# Altium project XInC2 Dev v2.0.0.PrjPCB
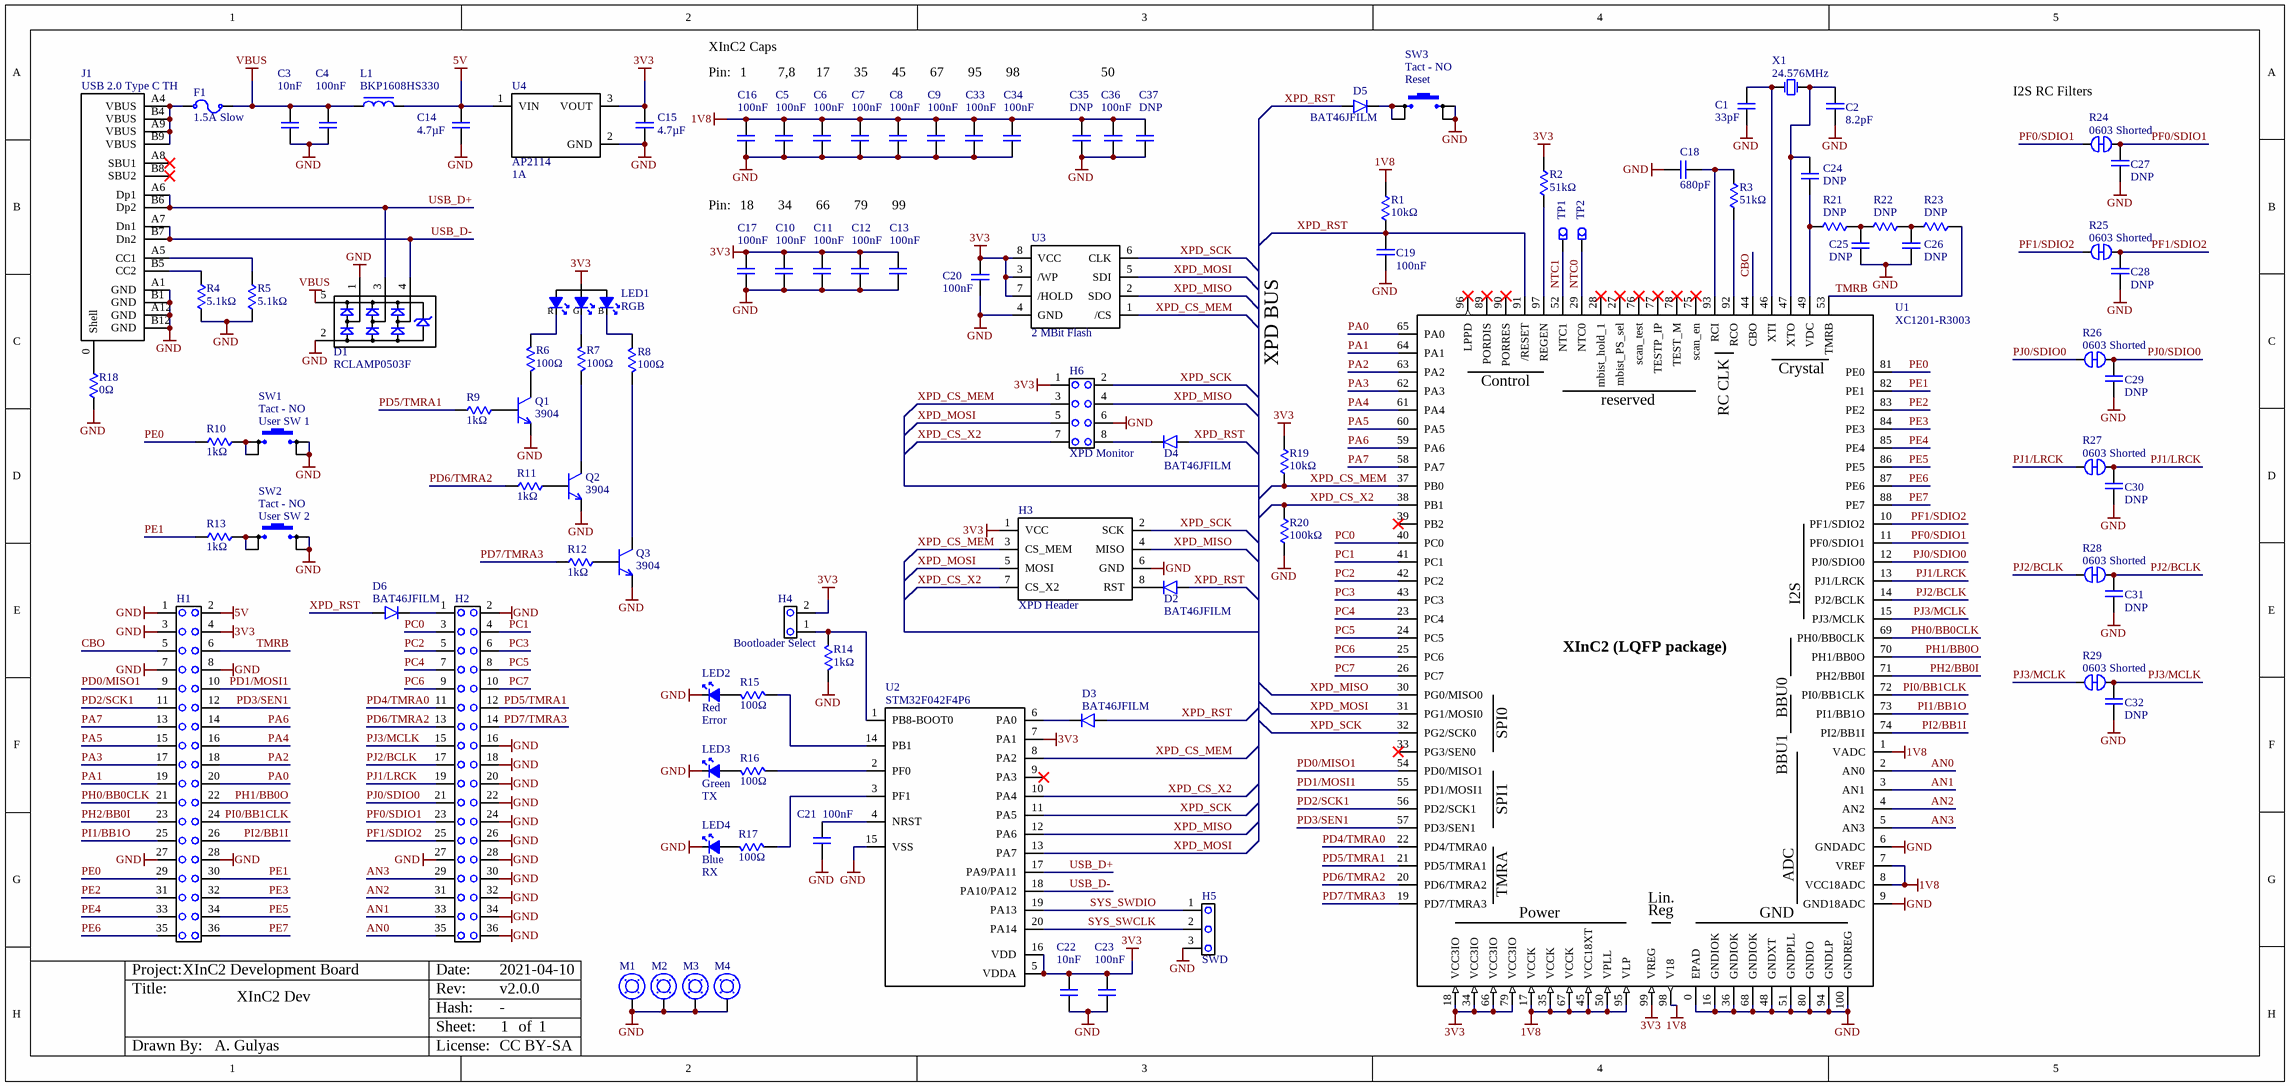
[diagram p0: XInC2 Dev - SCH v2.0.0 20210410.SchDoc]
1 sheet, 102 parts. Net scope: global (net labels, ports and power ports of the same name join across sheets).
Board file: XInC2 Dev - PCB v2.0 20210410.PcbDoc

## Sheet XInC2 Dev - SCH v2.0.0 20210410.SchDoc
size 457 x 215 mm; Date: 2021-04-10; Author: A. Gulyas; DrawnBy: A. Gulyas; Engineer: A. Gulyas; Revision: v2.0.0; SheetNumber: 1; SheetTotal: 1; Githash: -

### Parts
C1  33pF  [0603 - C]
C2  8.2pF  [0603 - C]
C3  10nF  [0603 - C]
C4  100nF  [0603 - C]
C5  100nF  [0603 - C]
C6  100nF  [0603 - C]
C7  100nF  [0603 - C]
C8  100nF  [0603 - C]
C9  100nF  [0603 - C]
C10  100nF  [0603 - C]
C11  100nF  [0603 - C]
C12  100nF  [0603 - C]
C13  100nF  [0603 - C]
C14  4.7µF  [0603 - C]
C15  4.7µF  [0603 - C]
C16  100nF  [0603 - C]
C17  100nF  [0603 - C]
C18  680pF  [0603 - C]
C19  100nF  [0603 - C]
C20  100nF  [0603 - C]
C21  100nF  [0603 - C]
C22  10nF  [0603 - C]
C23  100nF  [0603 - C]
C24  DNP  [0603 - C - DNP]
C25  DNP  [0603 - C - DNP]
C26  DNP  [0603 - C - DNP]
C27  DNP  [0603 - C - DNP]
C28  DNP  [0603 - C - DNP]
C29  DNP  [0603 - C - DNP]
C30  DNP  [0603 - C - DNP]
C31  DNP  [0603 - C - DNP]
C32  DNP  [0603 - C - DNP]
C33  100nF  [0603 - C]
C34  100nF  [0603 - C]
C35  DNP  [0603 - C - DNP]
C36  100nF  [0603 - C]
C37  DNP  [0603 - C - DNP]
D1  RCLAMP0503F  [SOT 353]
D2  BAT46JFILM  [SOD 323]
D3  BAT46JFILM  [SOD 323]
D4  BAT46JFILM  [SOD 323 and 0603]
D5  BAT46JFILM  [SOD 323]
D6  BAT46JFILM  [SOD 323]
F1  1.5A Slow  [Fuse - C1T Series]
H1  SSQ-118-03-T-D  [H - 100mil - 2x18 - Stack - bottom insert]  (value not drawn)
H2  SSQ-118-03-T-D  [H - 100mil - 2x18 - Stack - bottom insert]  (value not drawn)
H3  XPD Header  [H - XPD]
H4  Purpose: Bootloader Select  [H - 100mil - 1x2 - TH]  (hidden comment: H - 100mil - M - TH - 1x2)
H5  Purpose: SWD  [H - 100mil - 1x3 - TH]  (hidden comment: H - 100mil - M - TH - 1x3)
H6  Purpose: XPD Monitor  [H - 100mil - 2x4 - TH - DNP]  (hidden comment: H - 100mil - M - TH - 2x4)
J1  USB 2.0 Type C TH  [Jack - USB C - 2.0 - TH]
L1  BKP1608HS330  [0603 - R]
LED1  RGB  [LED - RGB - 0606]
LED2  Red  Purpose: Error  [LED - Red - 0603]
LED3  Green  Purpose: TX  [LED - Green - 0603]
LED4  Blue  Purpose: RX  [LED - Blue - 0603]
M1  Mech - Bolt Hole - M3  [Bolt Hole - M3]  (value not drawn)
M2  Mech - Bolt Hole - M3  [Bolt Hole - M3]  (value not drawn)
M3  Mech - Bolt Hole - M3  [Bolt Hole - M3]  (value not drawn)
M4  Mech - Bolt Hole - M3  [Bolt Hole - M3]  (value not drawn)
Q1  3904  [SOT 23 - NPN - MCC]
Q2  3904  [SOT 23 - NPN - MCC]
Q3  3904  [SOT 23 - NPN - MCC]
R1  10kΩ  [0603 - R]
R2  51kΩ  [0603 - R]
R3  51kΩ  [0603 - R]
R4  5.1kΩ  [0603 - R]
R5  5.1kΩ  [0603 - R]
R6  100Ω  [0603 - R]
R7  100Ω  [0603 - R]
R8  100Ω  [0603 - R]
R9  1kΩ  [0603 - R]
R10  1kΩ  [0603 - R]
R11  1kΩ  [0603 - R]
R12  1kΩ  [0603 - R]
R13  1kΩ  [0603 - R]
R14  1kΩ  [0603 - R]
R15  100Ω  [0603 - R]
R16  100Ω  [0603 - R]
R17  100Ω  [0603 - R]
R18  0Ω  [0603 - R]
R19  10kΩ  [0603 - R]
R20  100kΩ  [0603 - R]
R21  DNP  [0603 - R - DNP]
R22  DNP  [0603 - R - DNP]
R23  DNP  [0603 - R - DNP]
R24  0603 Shorted  [0603 - R - shorted jumper]
R25  0603 Shorted  [0603 - R - shorted jumper]
R26  0603 Shorted  [0603 - R - shorted jumper]
R27  0603 Shorted  [0603 - R - shorted jumper]
R28  0603 Shorted  [0603 - R - shorted jumper]
R29  0603 Shorted  [0603 - R - shorted jumper]
SW1  Tact - NO  Purpose: User SW 1  [SW - Tact - SMT]
SW2  Tact - NO  Purpose: User SW 2  [SW - Tact - SMT]
SW3  Tact - NO  Purpose: Reset  [SW - Tact - SMT]
TP1  Signal  [TP - TH - 0.6mm]  (value not drawn)
TP2  Signal  [TP - TH - 0.6mm]  (value not drawn)
U1  XC1201-R3003  [XInC2 LQFP 100]
U2  STM32F042F4P6  [TSSOP 20]
U3  2 MBit Flash  [SOIC 8]
U4  AP2114  Current - Output: 1A  [SOT 223]
X1  24.576MHz  [X - HC-49/US]

### Nets
1V8: C5.1 C6.1 C7.1 C8.1 C9.1 C16.1 C33.1 C34.1 C35.1 C36.1 C37.1 R1.2 U1.1(VADC) U1.7(VREF) U1.8(VCC18ADC) U1.17(VCCK) U1.35(VCCK) U1.45(VCC18XT) U1.50(VPLL) U1.67(VCCK) U1.95(VLP) U1.98(V18)
3V3: C10.1 C11.1 C12.1 C13.1 C15.1 C17.1 C20.1 C22.1 C23.1 H1.4 H3.1(VCC) H4.2 H6.1 LED1.4 R2.2 R19.2 U1.18(VCC3IO) U1.34(VCC3IO) U1.66(VCC3IO) U1.79(VCC3IO) U1.99(VREG) U2.5(VDDA) U2.7(PA1) U2.16(VDD) U3.3(/WP) U3.7(/HOLD) U3.8(VCC) U4.3(VOUT)
5V: C14.1 H1.2 L1.2 U4.1(VIN)
GND: C1.2 C2.2 C3.2 C4.2 C5.2 C6.2 C7.2 C8.2 C9.2 C10.2 C11.2 C12.2 C13.2 C14.2 C15.2 C16.2 C17.2 C18.1 C19.2 C20.2 C21.2 C22.2 C23.2 C25.2 C26.2 C27.2 C28.2 C29.2 C30.2 C31.2 C32.2 C33.2 C34.2 C35.2 C36.2 C37.2 D1.1 D1.2 H1.1 H1.3 H1.7 H1.8 H1.27 H1.28 H2.2 H2.16 H2.18 H2.20 H2.22 H2.24 H2.26 H2.27 H2.28 H2.30 H2.32 H2.34 H2.36 H3.6(GND) H5.3 H6.6 J1.A1(GND) J1.A12(GND) J1.B1(GND) J1.B12(GND) LED2.2 LED3.2 LED4.2 M1.1 M2.1 M3.1 M4.1 Q1.E Q2.E Q3.E R4.1 R5.1 R14.1 R18.1 R20.1 SW1.1 SW1.2 SW2.1 SW2.2 SW3.1 SW3.2 U1.0(EPAD) U1.6(GNDADC) U1.9(GND18ADC) U1.16(GNDIOK) U1.36(GNDIOK) U1.48(GNDXT) U1.51(GNDPLL) U1.68(GNDIOK) U1.80(GNDIO) U1.94(GNDLP) U1.100(GNDREG) U2.15(VSS) U3.4(GND) U4.2(GND)
VBUS: C3.1 C4.1 D1.5 F1.2 L1.1
AN0: H2.35 U1.2(AN0)
AN1: H2.33 U1.3(AN1)
AN2: H2.31 U1.4(AN2)
AN3: H2.29 U1.5(AN3)
CBO: H1.5 U1.44(CBO)
NTC0: TP2.1 U1.29(NTC0)
NTC1: TP1.1 U1.52(NTC1)
PA0: H1.20 U1.65(PA0)
PA1: H1.19 U1.64(PA1)
PA2: H1.18 U1.63(PA2)
PA3: H1.17 U1.62(PA3)
PA4: H1.16 U1.61(PA4)
PA5: H1.15 U1.60(PA5)
PA6: H1.14 U1.59(PA6)
PA7: H1.13 U1.58(PA7)
PC0: H2.3 U1.40(PC0)
PC1: H2.4 U1.41(PC1)
PC2: H2.5 U1.42(PC2)
PC3: H2.6 U1.43(PC3)
PC4: H2.7 U1.23(PC4)
PC5: H2.8 U1.24(PC5)
PC6: H2.9 U1.25(PC6)
PC7: H2.10 U1.26(PC7)
PD0/MISO1: H1.9 U1.54(PD0/MISO1)
PD1/MOSI1: H1.10 U1.55(PD1/MOSI1)
PD2/SCK1: H1.11 U1.56(PD2/SCK1)
PD3/SEN1: H1.12 U1.57(PD3/SEN1)
PD4/TMRA0: H2.11 U1.22(PD4/TMRA0)
PD5/TMRA1: H2.12 R9.1 U1.21(PD5/TMRA1)
PD6/TMRA2: H2.13 R11.1 U1.20(PD6/TMRA2)
PD7/TMRA3: H2.14 R12.1 U1.19(PD7/TMRA3)
PE0: H1.29 R10.1 U1.81(PE0)
PE1: H1.30 R13.1 U1.82(PE1)
PE2: H1.31 U1.83(PE2)
PE3: H1.32 U1.84(PE3)
PE4: H1.33 U1.85(PE4)
PE5: H1.34 U1.86(PE5)
PE6: H1.35 U1.87(PE6)
PE7: H1.36 U1.88(PE7)
PF0/SDIO1: C27.1 H2.23 R24.1 R24.2 U1.11(PF0/SDIO1)
PF1/SDIO2: C28.1 H2.25 R25.1 R25.2 U1.10(PF1/SDIO2)
PH0/BB0CLK: H1.21 U1.69(PH0/BB0CLK)
PH1/BB0O: H1.22 U1.70(PH1/BB0O)
PH2/BB0I: H1.23 U1.71(PH2/BB0I)
PI0/BB1CLK: H1.24 U1.72(PI0/BB1CLK)
PI1/BB1O: H1.25 U1.73(PI1/BB1O)
PI2/BB1I: H1.26 U1.74(PI2/BB1I)
PJ0/SDIO0: C29.1 H2.21 R26.1 R26.2 U1.12(PJ0/SDIO0)
PJ1/LRCK: C30.1 H2.19 R27.1 R27.2 U1.13(PJ1/LRCK)
PJ2/BCLK: C31.1 H2.17 R28.1 R28.2 U1.14(PJ2/BCLK)
PJ3/MCLK: C32.1 H2.15 R29.1 R29.2 U1.15(PJ3/MCLK)
SYS_SWCLK: H5.2 U2.20(PA14)
SYS_SWDIO: H5.1 U2.19(PA13)
TMRB: H1.6 R23.2 U1.53(TMRB)
USB_D+: D1.3 J1.A6(Dp1) J1.B6(Dp2) U2.17(PA9/PA11)
USB_D-: D1.4 J1.A7(Dn1) J1.B7(Dn2) U2.18(PA10/PA12)
XPD_CS_MEM: H3.3(CS_MEM) H6.3 R19.1 U1.37(PB0) U2.8(PA2) U3.1(/CS)
XPD_CS_X2: H3.7(CS_X2) H6.7 R20.2 U1.38(PB1) U2.10(PA4)
XPD_MISO: H3.4(MISO) H6.4 U1.30(PG0/MISO0) U2.12(PA6) U3.2(SDO)
XPD_MOSI: H3.5(MOSI) H6.5 U1.31(PG1/MOSI0) U2.13(PA7) U3.5(SDI)
XPD_RST: C19.1 D2.1 D3.1 D4.1 D5.1 D6.1 R1.1 U1.91(/RESET)
XPD_SCK: H3.2(SCK) H6.2 U1.32(PG2/SCK0) U2.11(PA5) U3.6(CLK)
NetC1_1: C1.1 U1.46(XTI) X1.1
NetC2_1: C2.1 C24.1 U1.47(XTO) X1.2
NetC18_2: C18.2 R3.2 U1.93(RCI)
NetC21_1: C21.1 U2.4(NRST)
NetC24_2: C24.2 R21.1 U1.49(VDC)
NetC25_1: C25.1 R21.2 R22.1
NetC26_1: C26.1 R22.2 R23.1
NetD2_2: D2.2 H3.8(RST)
NetD3_2: D3.2 U2.6(PA0)
NetD4_2: D4.2 H6.8
NetD5_2: D5.2 SW3.3 SW3.4
NetD6_2: D6.2 H2.1
NetF1_1: F1.1 J1.A4(VBUS) J1.A9(VBUS) J1.B4(VBUS) J1.B9(VBUS)
NetH4_1: H4.1 R14.2 U2.1(PB8-BOOT0)
NetJ1_0: J1.0(Shell) R18.2
NetJ1_A5: J1.A5(CC1) R5.2
NetJ1_B5: J1.B5(CC2) R4.2
NetLED1_1: LED1.1 R6.1
NetLED1_2: LED1.2 R7.1
NetLED1_3: LED1.3 R8.2
NetLED2_1: LED2.1 R15.2
NetLED3_1: LED3.1 R16.2
NetLED4_1: LED4.1 R17.1
NetQ1_B: Q1.B R9.2
NetQ1_C: Q1.C R6.2
NetQ2_B: Q2.B R11.2
NetQ2_C: Q2.C R7.2
NetQ3_B: Q3.B R12.2
NetQ3_C: Q3.C R8.1
NetR2_1: R2.1 U1.97(REGEN)
NetR3_1: R3.1 U1.92(RCO)
NetR10_2: R10.2 SW1.3 SW1.4
NetR13_2: R13.2 SW2.3 SW2.4
NetR15_1: R15.1 U2.14(PB1)
NetR16_1: R16.1 U2.2(PF0)
NetR17_2: R17.2 U2.3(PF1)

Not connected (* = marked no-connect by the designer): J1 A8(SBU1)* B8(SBU2)*; U1 27(mbist_PS_sel)* 28(mbist_hold_1)* 33(PG3/SEN0)* 39(PB2)* 75(scan_en)* 76(scan_test)* 77(TESTP_IP)* 78(TEST_M)* 89(PORDIS)* 90(PORRES)* 96(LPPD)*; U2 9(PA3)*

### Notes on the sheet
- XInC2 Caps
- Pin:
- 1
- 7,8
- 17
- 35
- 45
- 67
- 95
- 98
- 50
- I2S RC Filters
- 18
- 34
- 66
- 79
- 99
- XPD BUS
- (near H1) Project:
- (near H1) XInC2 Development Board
- (near H2) Date:
- (near H1) Title:
- XInC2 Dev
- (near H2) Rev:
- Hash:
- Sheet:
- of
- Drawn By:
- License:
- CC BY-SA
- (in symbol LED - RGB) R; G; B
- (in symbol uC - XInC2 - LQFP) Crystal; Control; reserved; RC CLK; I2S; XInC2 (LQFP package); BBU0; BBU1; SPI0; SPI1; ADC; TMRA; Lin.; Power; Reg; GND

### Library data of the parts
C1 = C - 0603 - 33pF - 16V_1: CAP CER 33PF 50V C0G/NPO 0603; MFG: Yageo; MFG PN: CC0603JRNPO9BN330; Tolerance: ±5%; Temp Coeff: NP0; Op Temp: -55°C ~ 125°C; Digi-Key PN: 311-1064-1-ND; Value: 33pF; Package: 0603; Series: CC; Price/1 @10: $0.058; Height: 0.9 mm; Composition: Ceramic; Voltage - Rated: 50V; Mounting Type: Surface Mount, MLCC
C2 = C - 0603 - 8.2pF - 50V: CAP CER 8.2PF 50V NPO 0603; MFG: Yageo; MFG PN: CC0603CRNPO9BN8R2; Tolerance: ±0.25pF; Temp Coeff: NP0; Op Temp: -55°C ~ 125°C; Digi-Key PN: 311-3865-1-ND; Value: 8.2pF; Package: 0603; Series: CC; Price/1 @10: $0.084; Height: 0.90mm; Composition: Ceramic; Voltage - Rated: 50V; Mounting Type: Surface Mount, MLCC
C3 C22 = C - 0603 - 10nF - 50V: CAP CER 10000PF 50V X7R 0603; MFG: Yageo; MFG PN: CC0603JRX7R9BB103; Tolerance: ±5%; Op Temp: -55°C ~ 125°C; Digi-Key PN: 311-1778-1-ND; Value: 10000pF; Package: 0603; Temp Coeff: X7R; Series: CC; Price/1 @10: $0.072; Height: 0.90mm; Composition: Ceramic; Voltage - Rated: 50V; Mounting Type: Surface Mount, MLCC; Size: 1.60mm x 0.80mm
C4-C13 C16 C17 C19-C21 C23 C33 C34 C36 = C - 0603 - 100nF - 16V: CAP CER 0.1UF 16V X7R 0603; MFG: Yageo; MFG PN: CC0603KRX7R7BB104; Value: 0.1µF; Tolerance: ±10%; Op Temp: -55°C ~ 125°C; Digi-Key PN: 311-1088-1-ND; Package: 0603; Temp Coeff: X7R; Series: CC; Price/1 @10: $0.064; Height: 0.9 mm; Composition: Ceramic; Voltage - Rated: 16V; Mounting Type: Surface Mount, MLCC
C14 C15 = C - 0603 - 4.7uF - 10V: CAP CER 4.7UF 10V X5R 0603; MFG: Yageo; MFG PN: CC0603MRX5R6BB475; Tolerance: ±20%; Op Temp: -55°C ~ 85°C; Digi-Key PN: 311-1820-1-ND; Value: 4.7µF; Package: 0603; Temp Coeff: X5R; Series: CC; Price/1 @10: $0.172; Height: 0.90mm; Composition: Ceramic; Voltage - Rated: 10V; Mounting Type: Surface Mount, MLCC
C18 = C - 0603 - 680pF - 50V: CAP CER 680PF 50V X7R 0603; MFG: Yageo; MFG PN: CC0603KRX7R9BB681; Tolerance: ±10%; Op Temp: -55°C ~ 125°C; Digi-Key PN: 311-1188-1-ND; Value: 680pF; Package: 0603; Temp Coeff: X7R; Series: CC; Price/1 @10: $0.062; Height: 0.90mm; Composition: ceramic; Voltage - Rated: 50V; Mounting Type: Surface Mount, MLCC
C24-C32 C35 C37 = C - 0603 - DNP: DNP C 0603; MFG: -; MFG PN: -; Digi-Key PN: -; Value: DNP; Package: 0603; Mounting Type: SMT
D1 = TVS - USB - RCLAMP0503F: TVS DIODE 5V 25V SC70-5; MFG: Semtech Corp; MFG PN: RCLAMP0503F.TCT; Op Temp: -55°C ~ 125°C (TJ); Type: Steering (Rail to Rail); Voltage - Reverse Standoff (Typ): 5V (Max); Voltage - Breakdown (Min): 6V; Current - Peak Pulse (10/1000µs): 6A (8/20µs); Power - Peak Pulse: 150W; Power Line Protection: Yes; Capacitance @ Frequency: 3pF @ 1MHz; Unidirectional Channels: 3; Digi-Key PN: RCLAMP0503F.TCTCT-ND; Mounting Type: Surface Mount; Package: 5-TSSOP, SC-70-5, SOT-353; Series: RailClamp; Voltage - Clamping (Max) @ Ipp: 25V; Applications: USB OTG; ComponentLink1Description: Datasheet; ComponentLink1URL: E:\!Projects\50. XInC2 Dev 2\git\Datasheets\Semtech - RClamp0503F.pdf; ComponentLink2Description: Online Datasheet; ComponentLink2URL: https://semtech.my.salesforce.com/sfc/p/#E0000000JelG/a/44000000MCna/gSoiWcGuNPdCJXQ9MiJb.gsVfITyRqZHeVmym5XjXO8
D2-D6 = D - BAT46JFILM: DIODE SCHOTTKY 100V 150MA SOD323; MFG: ST; Op Temp: 150°C (Max); Current - Average Rectified (Io): 150mA (DC); Speed: Small Signal =< 200mA (Io), Any Speed; Capacitance @ Vr, F: 10pF @ 0V, 1MHz; Voltage - Forward (Vf) (Max) @ If: 450mV @ 10mA; Current - Reverse Leakage @ Vr: 5µA @ 75V; Digi-Key PN: 497-6653-1-ND; MFG PN: BAT46JFILM; Mounting Type: Surface Mount; Package: SOD-323; Price/1 @10: $0.231; Series: -; Diode Type: Schottky; Voltage - DC Reverse (Vr) (Max): 100V; ComponentLink1Description: Datasheet; ComponentLink1URL: E:\!Projects\50. XInC2 Dev 2\git\Datasheets\ST - BAT46.pdf; ComponentLink2Description: Online Datasheet; ComponentLink2URL: https://www.st.com/content/ccc/resource/technical/document/datasheet/c6/32/d4/4a/28/d3/4b/11/CD00004930.pdf/files/CD00004930.pdf/jcr:content/translations/en.CD00004930.pdf
F1 = Fuse - 1.5A slow: FUSE 1.5A 63VAC/DC SLOW 1206; MFG: Bel Fuse Inc.; MFG PN: 0685T1500-01; Fuse Type: Board Mount (Cartridge Style Excluded); Response Time: Slow Blow; Breaking Capacity @ Rated Voltage: 50A; Approval Agency: AEC-Q200, CE, cURus; Op Temp: -55°C ~ 125°C; Melting I²t: 0.23; Voltage Rating - AC: 63V; DC Cold Resistance: 0.205 Ohms; Digi-Key PN: 507-1893-1-ND; Price/1 @10: $0.342; Series: C1T; Mounting Type: Surface Mount; Package: 1206; Current Rating (Amps): 1.5A; Voltage Rating - DC: 63V; ComponentLink1Description: Datasheet; ComponentLink1URL: E:\!Projects\50. XInC2 Dev 2\git\Datasheets\Bel Fuse - Type C1T.pdf; ComponentLink2Description: Online Datasheet; ComponentLink2URL: https://belfuse.com/resources/datasheets/circuitprotection/ds-cp-c1t-series.pdf
H1 H2 = H - 100mil - Stack - 2x18: CONN RCPT 36POS 0.1 TIN PCB; MFG: Samtec; Op Temp: -55°C ~ 105°C; Connector Type: Receptacle; Style: Board to Board or Cable; Number of Positions: 36; Number of Positions Loaded: All; Pitch - Mating: 0.100"; Contact Length - Post: 10.00mm; Material Flammability Rating: UL94 V-0; Current Rating (Amps): 6.3A per Contact; Voltage Rating: 550VAC; Digi-Key PN: SAM1204-18-ND; MFG PN: SSQ-118-03-T-D; Mounting Type: Thorugh Hole; Price/1 @10: $4.718; Series: SSQ; Contact Type: Forked; Row Spacing - Mating: 0.100"; Termination: Solder; Fastening Type: Push-Pull; Contact Finish - Mating: Tin; Insulation Color: Black; Insulation Height: 8.51mm; Contact Finish - Post: Tin; Insulation Material: Liquid Crystal Polymer (LCP); Contact Shape: Square; Number of Rows: 2; ComponentLink1Description: Datasheet; ComponentLink1URL: E:\!Projects\50. XInC2 Dev 2\git\Datasheets\Samtec - SSQ Series Headers.pdf; ComponentLink2Description: Online Datasheet; ComponentLink2URL: http://suddendocs.samtec.com/catalog_english/ssq_th.pdf; Purpose: *
H3 = H - XPD - SMT: CONN HEADER SMD 8POS 1.27MM; MFG: Samtec Inc.; MFG PN: FTS-104-01-L-DV; Op Temp: -55°C ~ 125°C; Connector Type: Header, Cuttable; Pitch - Mating: 0.050"" (1.27mm); Number of Positions: 8; Shrouding: Unshrouded; Contact Length - Mating: 0.120"" (3.05mm); Material Flammability Rating: UL94 V-0; Current Rating (Amps): 3.4A per Contact; Digi-Key PN: SAM1157-04-ND; Height: 4.32mm; Mounting Type: Surface Mount; Price/1 @10: $1.616; Series: FTS; Contact Type: Male Pin; Number of Rows: 2; Row Spacing - Mating: 0.050"" (1.27mm); Termination: Solder; Fastening Type: Push-Pull; Insulation Height: 0.034"" (0.86mm); Contact Shape: Square; Contact Finish - Mating: Gold; Insulation Material: Liquid Crystal Polymer (LCP); Insulation Color: Black; ComponentLink1Description: Datasheet; ComponentLink1URL: E:\!Projects\50. XInC2 Dev 2\git\Datasheets\Samtec - FTS series.pdf; ComponentLink2Description: Online Datasheet; ComponentLink2URL: http://suddendocs.samtec.com/catalog_english/fts.pdf
H4 = H - 100mil - M - TH - 1x2: CONN HEADER VERT 2POS 2.54MM
H5 = H - 100mil - M - TH - 1x3: CONN HEADER VERT 3POS 2.54MM
J1 = Jack - USB C - USB4085: CONN RCPT USB2.0 TYPEC 16POS; MFG: GCT; MFG PN: USB4085-GF-A; Op Temp: -40°C ~ 85°C; Connector Type: USB-C (USB TYPE-C); Number of Contacts: 24 (16+8 Dummy); Gender: Receptacle; Current Rating (Amps): 0.25A, 1.25A, 3A, 4.25A; Voltage - Rated: 20VDC; Mating Cycles: 10000; Shielding: Shielded; Material Flammability Rating: UL94 V-0; Number of Ports: 1; Digi-Key PN: 2073-USB4085-GF-ACT-ND; Height: 3.46mm; Mounting Type: Through Hole, Right Angle; Price/1 @10: $1.629; Series: USB4085; Specifications: USB 2.0; Mounting Feature: Horizontal; Contact Finish: Gold; Shell/Shielding Material: Steel, Stainless; Insulation Color: Black; ComponentLink1Description: Datasheet; ComponentLink1URL: E:\!Projects\50. XInC2 Dev 2\git\Datasheets\GCT - USB4085.pdf; ComponentLink2Description: Online Datasheet; ComponentLink2URL: https://gct.co/files/drawings/usb4085.pdf
L1 = Ferrite - 0603 - 33 ohm: FERRITE BEAD 33 OHM 0603 1LN; MFG: Taiyo Yuden; MFG PN: BKP1608HS330-T; Op Temp: -55°C ~ 85°C; Filter Type: Power Line; Current Rating (Max): 3A; DC Resistance (DCR) (Max): 25mOhm; Number of Lines: 1; Impedance @ Frequency: 33 Ohms @ 100MHz; Digi-Key PN: 587-1926-1-ND; Height: 0.95mm; Mounting Type: Surface Mount; Package: 0603; Series: BK; Size: 1.60mm x 0.80mm; Price/1 @10: $0.10
LED1 = LED - RGB: LED RGB CLEAR 4SMD; MFG: Everlight Electronics; MFG PN: EAST1616RGBB4; Lens Color: Colorless; Lens Style: Rectangle with Flat Top; Lens Size: 1.60mm x 1.10mm; Voltage - Forward (Vf) (Typ): 1.8V Red, 2.8V Green, 2.8V Blue; Current - Test: 5mA Red, 5mA Green, 5mA Blue; Viewing Angle: 120°; Wavelength - Peak: 632nm Red, 518nm Green, 468nm Blue; Digi-Key PN: 1080-1552-1-ND; Height: 0.45mm; Mounting Type: Surface Mount; Package: 0606; Size: 1.60mm L x 1.60mm W; Color: RGB; Lens Transparency: Clear; Millicandela Rating: -; Wavelength - Dominant: -; Price/1 @10: $0.415; Purpose: *; ComponentLink1Description: Datasheet; ComponentLink1URL: E:\!Projects\50. XInC2 Dev 2\git\Datasheets\Everlight - EAST1616RGBB4.PDF; ComponentLink2Description: Online Datasheet; ComponentLink2URL: https://everlightamericas.com/index.php?controller=attachment&id_attachment=2827
LED2 = LED - Red: LED RED CLEAR CHIP SMD; MFG: Lite-On Inc.; MFG PN: LTST-C190KRKT; Lens Color: Colorless; Millicandela Rating: 99mcd; Lens Style: Rectangle with Flat Top; Lens Size: 1.10mm x 0.80mm; Voltage - Forward (Vf) (Typ): 2V; Current - Test: 20mA; Viewing Angle: 130°; Wavelength - Dominant: 631nm; Wavelength - Peak: 639nm; Digi-Key PN: 160-1436-1-ND; Height: 0.90mm; Mounting Type: Surface Mount; Package: 0603; Size: 1.60mm L x 0.80mm W; Color: Red; Lens Transparency: Clear; Price/1 @10: $0.183; ComponentLink1Description: Datasheet; ComponentLink1URL: E:\!Projects\50. XInC2 Dev 2\git\Datasheets\Lite-On - Red - LTST-C190KRKT.pdf; ComponentLink2Description: Online Datasheet; ComponentLink2URL: https://optoelectronics.liteon.com/upload/download/DS-22-99-0151/LTST-C190KRKT.pdf
LED3 = LED - Green: LED GREEN CLEAR CHIP SMD; MFG: Lite-On Inc.; MFG PN: LTST-C190KGKT; Lens Color: Colorless; Millicandela Rating: 35mcd; Lens Style: Rectangle with Flat Top; Lens Size: 1.10mm x 0.80mm; Voltage - Forward (Vf) (Typ): 2V; Current - Test: 20mA; Viewing Angle: 130°; Wavelength - Dominant: 571nm; Wavelength - Peak: 574nm; Digi-Key PN: 160-1435-1-ND; Height: 0.90mm; Mounting Type: Surface Mount; Package: 0603; Size: 1.60mm L x 0.80mm W; Color: Green; Lens Transparency: Clear; Price/1 @10: $0.183; ComponentLink1Description: Datasheet; ComponentLink1URL: E:\!Projects\50. XInC2 Dev 2\git\Datasheets\Lite-On - Green - LTST-C190KGKT.pdf; ComponentLink2Description: Online Datasheet; ComponentLink2URL: https://optoelectronics.liteon.com/upload/download/DS22-2000-074/LTST-C190KGKT.PDF
LED4 = LED - Blue: LED BLUE CLEAR CHIP SMD; MFG: Lite-On Inc.; MFG PN: LTST-C190TBKT; Lens Color: Colorless; Millicandela Rating: 104mcd; Lens Style: Rectangle with Flat Top; Lens Size: 1.10mm x 0.80mm; Voltage - Forward (Vf) (Typ): 3.3V; Current - Test: 20mA; Viewing Angle: 130°; Wavelength - Dominant: 470nm; Wavelength - Peak: 468nm; Digi-Key PN: 160-1646-1-ND; Height: 0.90mm; Mounting Type: Surface Mount; Package: 0603; Size: 1.60mm L x 0.80mm W; Color: Blue; Lens Transparency: Clear; ComponentLink1Description: Online; ComponentLink1URL: E:\!Projects\50. XInC2 Dev 2\git\Datasheets\Lite-On - Blue - LTST-C190TBKT.PDF; ComponentLink2Description: Online Datasheet; ComponentLink2URL: https://optoelectronics.liteon.com/upload/download/DS-22-99-0224/LTST-C190TBKT.PDF; Price/1 @10: $0.378
Q1-Q3 = Q - NPN - MMBT3904: TRANS NPN 40V 0.2A SOT23; MFG: Micro Commercial; MFG PN: MMBT3904-TP; Op Temp: -55°C ~ 150°C (TJ); Vce Saturation (Max) @ Ib, Ic: 300mV @ 5mA, 50mA; Current - Collector Cutoff (Max): 50nA (ICBO); DC Current Gain (hFE) (Min) @ Ic, Vce: 100 @ 10mA, 1V; Frequency - Transition: 300MHz; Current - Collector (Ic) (Max): 200mA; Power - Max: 350mW; ComponentLink1Description: Datasheet; ComponentLink1URL: E:\!Projects\50. XInC2 Dev 2\git\Datasheets\MCC - MMBT3904.pdf; ComponentLink2Description: Online Datasheet; ComponentLink2URL: https://www.mccsemi.com/pdf/Products/MMBT3904(SOT-23).pdf; Digi-Key PN: MMBT3904TPMSCT-ND; Mounting Type: Surface Mount; Package: SOT-23, TO-236-3, SC-59, SOT-23-3; Price/1 @10: $0.087; Transistor Type: NPN; Voltage - Collector Emitter Breakdown (Max): 40V
R1 R19 = R - 0603 - 10k: RES SMD 10K OHM 5% 1/10W 0603; MFG PN: RC0603JR-0710KL; MFG: Yageo; Power: 0.1W; Temp Coeff: ±100ppm/°C; Op Temp: -55°C ~ 155°C; Value: 10 kOhms; Digi-Key PN: 311-10KGRCT-ND; Price/1 @10: $0.017; Height: 0.55mm; Package: 0603; Composition: Thick Film; Tolerance: 5%; Series: RC; Mounting Type: Surface Mount; ComponentLink1Description: Datasheet; ComponentLink1URL: E:\!Projects\50. XInC2 Dev 2\git\Datasheets\Yageo - RC series.pdf; ComponentLink2Description: Online Datasheet; ComponentLink2URL: https://www.yageo.com/upload/media/product/productsearch/datasheet/rchip/PYu-RC_Group_51_RoHS_L_11.pdf
R2 R3 = R - 0603 - 51k: RES SMD 51K OHM 5% 1/10W 0603; MFG PN: RC0603JR-0751KL; MFG: Yageo; Power: 0.1W; Temp Coeff: ±100ppm/°C; Op Temp: -55°C ~ 155°C; Value: 51 kOhms; Digi-Key PN: 311-51KGRCT-ND; Price/1 @10: $0.025; Height: 0.55mm; Package: 0603; Composition: Thick Film; Tolerance: 5%; Series: RC; Mounting Type: Surface Mount; ComponentLink1Description: Datasheet; ComponentLink1URL: E:\!Projects\50. XInC2 Dev 2\git\Datasheets\Yageo - RC series.pdf; ComponentLink2Description: Online Datasheet; ComponentLink2URL: https://www.yageo.com/upload/media/product/productsearch/datasheet/rchip/PYu-RC_Group_51_RoHS_L_11.pdf
R4 R5 = R - 0603 - 5.1k: RES SMD 5.1K OHM 5% 1/10W 0603; MFG PN: RC0603JR-075K1L; MFG: Yageo; Power: 0.1W; Temp Coeff: ±100ppm/°C; Op Temp: -55°C ~ 155°C; Value: 5.1 kOhms; Digi-Key PN: 311-5.1KGRCT-ND; Price/1 @10: $0.02500; Height: 0.55mm; Package: 0603; Composition: Thick Film; Tolerance: 5%; Series: RC; Mounting Type: Surface Mount; ComponentLink1Description: Datasheet; ComponentLink1URL: E:\!Projects\50. XInC2 Dev 2\git\Datasheets\Yageo - RC series.pdf; ComponentLink2Description: Online Datasheet; ComponentLink2URL: https://www.yageo.com/upload/media/product/productsearch/datasheet/rchip/PYu-RC_Group_51_RoHS_L_11.pdf
R6-R8 R15-R17 = R - 0603 - 100R: RES SMD 100 OHM 5% 1/10W 0603; MFG PN: RC0603JR-07100RL; MFG: Yageo; Power: 0.1W; Temp Coeff: ±100ppm/°C; Op Temp: -55°C ~ 155°C; Value: 100 Ohms; Digi-Key PN: 311-100GRCT-ND; Price/1 @10: $0.02500; Height: 0.55mm; Package: 0603; Composition: Thick Film; Tolerance: 5%; Series: RC; Mounting Type: Surface Mount; ComponentLink1Description: Datasheet; ComponentLink1URL: E:\!Projects\50. XInC2 Dev 2\git\Datasheets\Yageo - RC series.pdf; ComponentLink2Description: Online Datasheet; ComponentLink2URL: https://www.yageo.com/upload/media/product/productsearch/datasheet/rchip/PYu-RC_Group_51_RoHS_L_11.pdf
R9-R14 = R - 0603 - 1k: RES SMD 1K OHM 5% 1/10W 0603; MFG PN: RC0603JR-071KL; MFG: Yageo; Power: 0.1W; Temp Coeff: ±100ppm/°C; Op Temp: -55°C ~ 155°C; Value: 1 kOhms; Digi-Key PN: 311-1.0KGRCT-ND; Price/1 @10: $0.02500; Height: 0.55mm; Package: 0603; Composition: Thick Film; Tolerance: 5%; Series: RC; Mounting Type: Surface Mount; ComponentLink1Description: Datasheet; ComponentLink1URL: E:\!Projects\50. XInC2 Dev 2\git\Datasheets\Yageo - RC series.pdf; ComponentLink2Description: Online Datasheet; ComponentLink2URL: https://www.yageo.com/upload/media/product/productsearch/datasheet/rchip/PYu-RC_Group_51_RoHS_L_11.pdf
R18 = Jumper - 0603: RES SMD 0 OHM JUMPER 1/10W 0603; MFG PN: RC0603JR-070RL; MFG: Yageo; Power: 0.1W; Op Temp: -55°C ~ 155°C; Value: 0 Ohms; Footprint: 0603; Digi-Key PN: 311-0.0GRCT-ND; Price/1 @10: $0.025; Temp Coeff: -; Height: 0.55mm; Package: 0603; Composition: Thick Film; Tolerance: Jumper; Series: RC; Mounting Type: Surface Mount
R20 = R - 0603 - 100k: RES SMD 100K OHM 5% 1/10W 0603; MFG PN: RC0603JR-07100KL; MFG: Yageo; Power: 0.1W; Temp Coeff: ±100ppm/°C; Op Temp: -55°C ~ 155°C; Value: 100 kOhms; Digi-Key PN: 311-100KGRCT-ND; Price/1 @10: $0.025; Height: 0.55mm; Package: 0603; Composition: Thick Film; Tolerance: 5%; Series: RC; Mounting Type: Surface Mount; ComponentLink1Description: Datasheet; ComponentLink1URL: E:\!Projects\50. XInC2 Dev 2\git\Datasheets\Yageo - RC series.pdf; ComponentLink2Description: Online Datasheet; ComponentLink2URL: https://www.yageo.com/upload/media/product/productsearch/datasheet/rchip/PYu-RC_Group_51_RoHS_L_11.pdf
R21-R23 = R - 0603 - DNP: DNP R 0603; MFG PN: -; MFG: -; Digi-Key PN: -; Value: DNP; Package: 0603; Mounting Type: SMT
R24-R29 = Jumper - 0603 - Shorted: DNP: 0603 Resistor with the pads shorted; MFG PN: RC0603JR-070RL; MFG: Yageo; Power: 0.1W; Op Temp: -55°C ~ 155°C; Value: 0 Ohms; Tolerance: Jumper; Footprint: 0603; Digi-Key PN: 311-0.0GRCT-ND; Price/1 @10: $0.025; Temp Coeff: -; Height: 0.55mm; Package: 0603; Composition: Thick Film; Series: RC; Mounting Type: Surface Mount
SW1-SW3 = SW - Tactile - HP0315AFKP2-R: SWITCH TACTILE SPST-NO 3VA 28V; MFG: NKK Switches; Switch Function: Off-Mom; Contact Rating @ Voltage: 3VA @ 28VDC; Actuator Type: Standard; Actuator Height off PCB, Vertical: 4.40mm; Actuator Orientation: Top Actuated; Outline: 6.20mm x 6.20mm; Illumination: Non-Illuminated; Operating Force: 160gf; Op Temp: -20°C ~ 70°C; Actuator Material: Polyamide (PA), Nylon, Glass Filled; Switch Travel: 0.20mm; Mechanical Life: 500,000 Cycles; ComponentLink1Description: Datasheet; ComponentLink1URL: E:\!Projects\50. XInC2 Dev 2\git\Datasheets\NKK Switches - HP03 Switches.pdf; ComponentLink2Description: Online Datasheet; ComponentLink2URL: https://www.nkkswitches.com/pdf/HP03-2.pdf; Digi-Key PN: 360-2595-1-ND; MFG PN: HP0315AFKP2-R; Mounting Type: Surface Mount; Price/1 @10: $0.78; Series: HP03; Circuit: SPST-NO; Termination Style: Gull Wing; Features: Sealed - Flux Protection
TP1 TP2 = TP - TH - 0.6 mm
U1 = uC - XInC2 - LQFP: XInC2 Multi-Threaded µC LQFP; MFG: Eleven Engineering; Digi-Key PN: N/A; MFG PN: XC1201-R3003
U2 = uC - STM32F042F4P6: IC MCU 32BIT 16KB FLASH 20TSSOP; MFG: ST; Op Temp: -40°C ~ 85°C (TA); Speed: 48MHz; Core Processor: ARM® Cortex®-M0; Core Size: 32-Bit; Peripherals: DMA, I²S, POR, PWM, WDT; Connectivity: CANbus, HDMI-CEC, I²C, IrDA, LINbus, SPI, UART/USART, USB; Program Memory Size: 16KB (16K x 8); RAM Size: 6K x 8; Voltage - Supply (Vcc/Vdd): 1.65V ~ 3.6V; Data Converters: A/D 12x12b; Number of I/O: 16; ComponentLink1Description: Datasheet; ComponentLink1URL: E:\!Projects\50. XInC2 Dev 2\git\Datasheets\ST - STM32F042F4P6.pdf; ComponentLink2Description: Online Datasheet; ComponentLink2URL: https://www.st.com/content/ccc/resource/technical/document/datasheet/52/ad/d0/80/e6/be/40/ad/DM00105814.pdf/files/DM00105814.pdf/jcr:content/translations/en.DM00105814.pdf; Digi-Key PN: 497-17343-ND; Height: 1.2 mm; MFG PN: STM32F042F4P6; Mounting Type: Surface Mount; Package: 20-TSSOP (0.173"", 4.40mm Width); Price/1 @10: $3.667; Series: STM32F0; Program Memory Type: FLASH
U3 = Mem - Flash - 2 MBit - W25Q20CL: IC FLASH 2MBIT SPI 104MHZ 8SOIC; MFG: Winbond Electronics; MFG PN: W25Q20CLSNIG; Memory Type: Non-Volatile; Memory Size: 2Mb (256K x 8); Write Cycle Time - Word, Page: 800µs; Voltage - Supply: 2.3V ~ 3.6V; Op Temp: -40°C ~ 85°C (TA); ComponentLink1Description: Datasheet; ComponentLink1URL: E:\!Projects\50. XInC2 Dev 2\git\Datasheets\Winbond - W25Q20CLA.pdf; ComponentLink2Description: Online Datasheet; ComponentLink2URL: https://www.winbond.com/resource-files/da00-w25q20cla1.pdf; Digi-Key PN: W25Q20CLSNIG-ND; Price/1 @10: $0.497; Series: SpiFlash; Technology: FLASH - NOR; Memory Interface: SPI; Mounting Type: Surface Mount; Package: 8-SOIC (0.154"", 3.90mm Width); Clock Frequency: 104MHz
U4 = Reg - Lin - 3.3V - AP2114: IC REG LINEAR 3.3V 1A SOT223; MFG: Diodes Inc; MFG PN: AP2114HA-3.3TRG1; Op Temp: -40°C ~ 85°C; Output Configuration: Positive; Output Type: Fixed; Voltage - Input (Max): 6V; Voltage Dropout (Max): 0.75V @ 1A; PSRR: 65dB (100Hz ~ 1kHz); Protection Features: Over Current, Over Temperature; Number of Regulators: 1; Current - Quiescent (Iq): 90µA; ComponentLink1Description: Datasheet; ComponentLink1URL: E:\!Projects\50. XInC2 Dev 2\git\Datasheets\BCD - AP2114.pdf; ComponentLink2Description: Online Datasheet; ComponentLink2URL: https://www.diodes.com/assets/Datasheets/AP2114.pdf; Digi-Key PN: AP2114HA-3.3TRG1DICT-ND; Height: 1.8 mm; Mounting Type: Surface Mount; Package: TO-261-4, TO-261AA, SOT-223; Price/1 @10: $0.444; Voltage - Output (Min/Fixed): 3.3V; Voltage - Output (Max): -
X1 = X - 20 MHz - HJ24.576: CRYSTAL 24.576MHZ SMD; MFG: Huijing; Op Temp: -20°C - +70°C; Frequency Stability: ±10PPM Max. / -20°C~+70°C; Frequency Tolerance: ±10PPM; Load Capacitance: 20pF; Operating Mode: Fund (AT Cut); ESR: 50Ω Max./Series; Digi-Key PN: N/A; Height: 4mm; MFG PN: N/A; Mounting Type: Surface Mount; Package: HC-49; Price/1 @10: -; ComponentLink1Description: Datasheet; ComponentLink1URL: E:\!Projects\50. XInC2 Dev 2\git\Datasheets\Huijing - 49SMD 24.576MHz.pdf; Series: -; Type: MHz Crystal; Frequency: 24.576MHz